# Altium project CHARGE_BOARD.PrjPcb
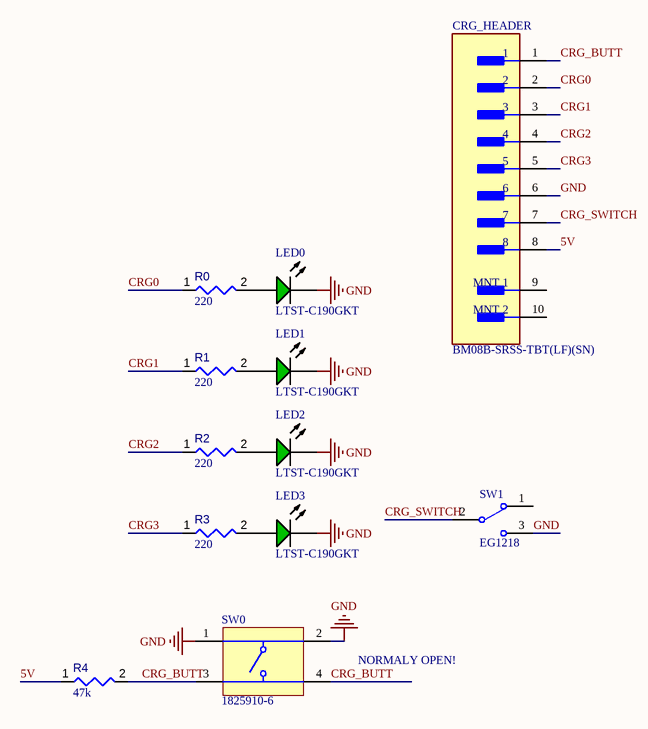
[diagram p0: CRG.SchDoc]
1 sheet, 12 parts. Net scope: global (net labels, ports and power ports of the same name join across sheets).
Board file: CRG.PcbDoc

## Sheet CRG.SchDoc
size Letter; SheetNumber: 1; SheetTotal: 1

### Parts
CRG_HEADER  BM08B-SRSS-TBT(LF)(SN)  [FP-BM08B-SRSS-TBT_LF_SN-MFG]
LED0  LTST-C190GKT  [LTST-C190GKT_V]
LED1  LTST-C190GKT  [LTST-C190GKT_V]
LED2  LTST-C190GKT  [LTST-C190GKT_V]
LED3  LTST-C190GKT  [LTST-C190GKT_V]
R0  value 220  [RESC1608X55X30LL20T10]  (hidden comment: RK73B1JTTD221J)
R1  value 220  [RESC1608X55X30LL20T10]  (hidden comment: RK73B1JTTD221J)
R2  value 220  [RESC1608X55X30LL20T10]  (hidden comment: RK73B1JTTD221J)
R3  value 220  [RESC1608X55X30LL20T10]  (hidden comment: RK73B1JTTD221J)
R4  value 47k  [RESC1005X40X25NL05T10]  (hidden comment: RC0402FR-0747KL)
SW0  1825910-6  [TECO-1825910-6_V]
SW1  EG1218  [ESWI-EG1218_V]

### Nets
GND: CRG_HEADER.6 LED0.2(K) LED1.2(K) LED2.2(K) LED3.2(K) SW0.1 SW0.2 SW1.3
5V: CRG_HEADER.8 R4.1
CRG0: CRG_HEADER.2 R0.1
CRG1: CRG_HEADER.3 R1.1
CRG2: CRG_HEADER.4 R2.1
CRG3: CRG_HEADER.5 R3.1
CRG_BUTT: CRG_HEADER.1 R4.2 SW0.3 SW0.4
CRG_SWITCH: CRG_HEADER.7 SW1.2(COM)
NetLED0_1: LED0.1(A) R0.2
NetLED1_1: LED1.1(A) R1.2
NetLED2_1: LED2.1(A) R2.2
NetLED3_1: LED3.1(A) R3.2

Not connected (* = marked no-connect by the designer): CRG_HEADER 9(MNT_1) 10(MNT_2); SW1 1

### Notes on the sheet
- NORMALY OPEN!

### Library data of the parts
CRG_HEADER = CMP-002-00076-1: Conn Shrouded Header HDR 8 POS 1mm Solder ST SMD T/R / CONN HEADER SH 8POS TOP 1MM TIN
LED0-LED3 = CMP-007-00022-2: LED Uni-Color Green, 100 mW, 30 mA, -55 to 85 degC, 2-Pin SMD, RoHS, Tape and Reel; Manufacturer: Lite-On; Power: 100mW; Forward Voltage: 2.1V; Viewing Angle: 130degrees; Forward Current: 20mA; Luminous Intensity: 6mcd; Lens Style: Clear; Manufacturer URL: http://www.us.liteon.com/; RoHS Compliant: True; Colour: Green; Package Description: 2-Pin Surface Mount Device, Body 1.6 x 0.8 mm; Datasheet URL: http://datasheet.octopart.com/LTST-C190GKT-Lite-On-datasheet-158530.pdf; Datasheet Version: Dec-06; Mounting Technology: SM; Case/Package: 0603; Package Reference: C190GKT; Packaging: TapeandReel; Min Operating Temperature: -55°C; Nominal Vf: 2.1V; Package Quantity: 3000; Illumination Colour: Green; Max Operating Temperature: 85°C; Pins: 2
R0-R3 = CMP-009-00180-2: Fixed Resistor, Metal Glaze/thick Film, 0.125W, 220ohm, 75V, 5% +/-Tol, 200ppm/Cel, Surface Mount, 0603; Max Operating Temperature: 155°C; RoHS Compliant: Yes; Tolerance: 5%; Min Operating Temperature: -55°C
R4 = CMP-009-00178-2: Fixed Resistor, Metal Glaze/thick Film, 0.0625W, 47000ohm, 50V, 1% +/-Tol, 100ppm/Cel, Surface Mount, 0402; RoHS Compliant: Yes; Min Operating Temperature: -55°C; Max Operating Temperature: 155°C; Tolerance: 1%
SW0 = CMP-011-00015-1: Keypad Switch, 1 Switches, SPST, Momentary-tactile, 0.05A, 24VDC, 2.06N, 4 PCB Hole Cnt, Solder Terminal, Through Hole-straight; Max Operating Temperature: 85°C; RoHS Compliant: Yes; Min Operating Temperature: -35°C
SW1 = CMP-011-00006-3: Slide Switch, SPDT, 500 V, -20 to 70 degC, 3-Pin THD, RoHS, Bulk; Manufacturer: E-Switch; Voltage Rating (DC): 30V; Current Rating: 200mA; Operating Force: 250gf; Package Quantity: 1000; Contact Plating: Silver; Max Operating Temperature: 70°C; Min Operating Temperature: -20°C; Contact Material: Copper; Datasheet URL: https://www.e-switch.com/system/asset/product_line/data_sheet/119/EG.pdf; Contact Finish: Silver; Case/Package: EG1218; Voltage Rating (AC): 30V; Datasheet Version: Oct-15; Package Description: 3-Pin Through Hole Device, Body 11.6 x 4 mm, Pitch 2.5 mm; RoHS Compliant: True; Package Reference: EG1218; Manufacturer URL: http://www.e-switch.ch/en/; Throw Configuration: SPDT; Contact Current Rating: 200mA; Mounting Technology: TH; Packaging: Bulk; Pins: 3